# EAGLE design Small_robot_PCB_schematic (EAGLE 7.7.0)
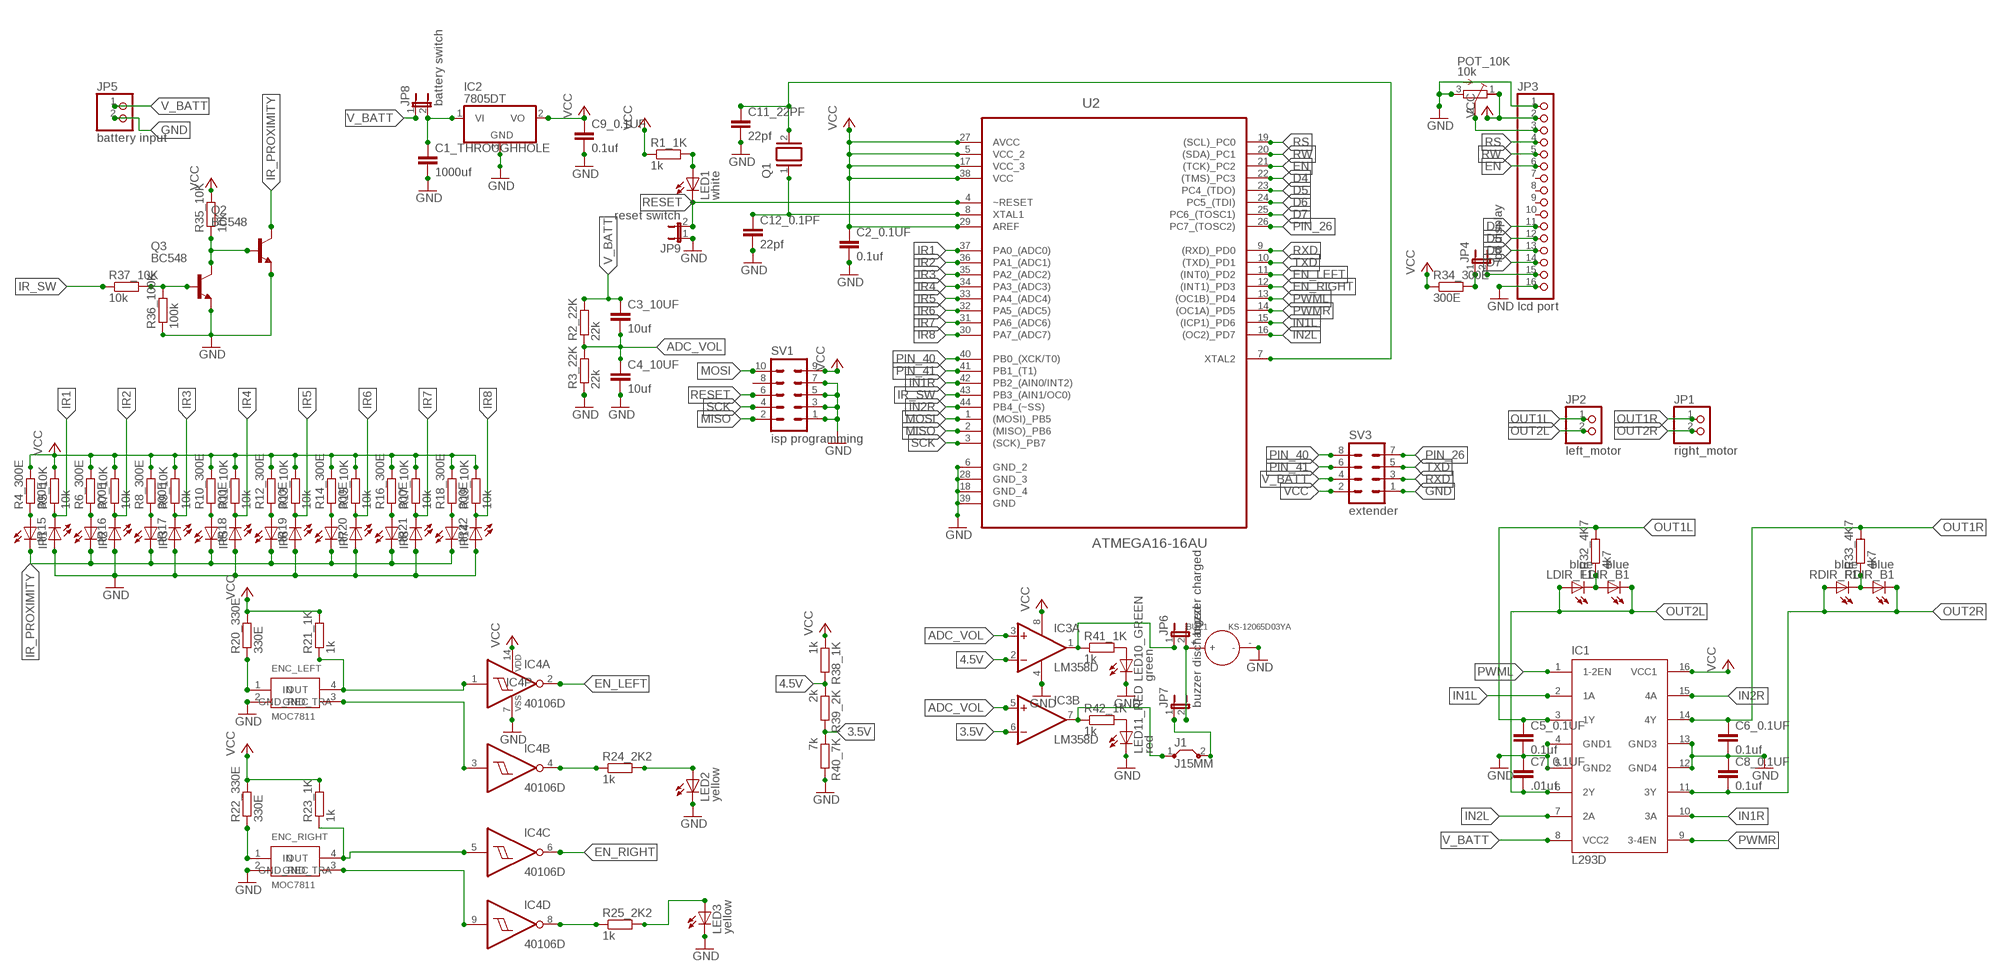
[diagram p0: schematic, sheet 1]

## Parts
BUZ1  KS-12065D03YA  DIP-BUZZER-3V(KS-12065D03YA)  [BZ2-7.6-D12.0XH6.5MM]
C1_THROUGHHOLE  1000uf  C-EU050-045X075  [C050-045X075]
C2_0.1UF  0.1uf  C-EUC1206  [C1206]
C3_10UF  10uf  C-EUC1206  [C1206]
C4_10UF  10uf  C-EUC1206  [C1206]
C5_0.1UF  0.1uf  C-EUC1206  [C1206]
C6_0.1UF  0.1uf  C-EUC1206  [C1206]
C7_0.1UF  .01uf  C-EUC1206  [C1206]
C8_0.1UF  0.1uf  C-EUC1206  [C1206]
C9_0.1UF  0.1uf  C-EUC1206  [C1206]
C11_22PF  22pf  C-EUC1206  [C1206]
C12_0.1PF  22pf  C-EUC1206  [C1206]
ENC_LEFT  MOC7811  [THROUGH_HOLE_NORMAL]
ENC_RIGHT  MOC7811  [THROUGH_HOLE_NORMAL]
IC1  L293D  [DIL16]
IC2  7805DT  [TO252]
IC3  LM358D  [SO08]
IC4  40106D  [SO14]
IR1  LED5MM  [LED5MM]
IR2  LED5MM  [LED5MM]
IR3  LED5MM  [LED5MM]
IR5  LED5MM  [LED5MM]
IR6  LED5MM  [LED5MM]
IR7  LED5MM  [LED5MM]
IR8  LED5MM  [LED5MM]
IR14  LED5MM  [LED5MM]
IR15  LED5MM  [LED5MM]
IR16  LED5MM  [LED5MM]
IR17  LED5MM  [LED5MM]
IR18  LED5MM  [LED5MM]
IR19  LED5MM  [LED5MM]
IR20  LED5MM  [LED5MM]
IR21  LED5MM  [LED5MM]
IR22  LED5MM  [LED5MM]
J1  J15MM  [15]
JP1  right_motor  PINHD-1X2  [1X02]
JP2  left_motor  PINHD-1X2  [1X02]
JP3  lcd port  PINHD-1X16  [1X16]
JP4  lcd display  JP1E  [JP1]
JP5  battery input  PINHD-1X2  [1X02]
JP6  buzzer charged  JP1E  [JP1]
JP7  buzzer discharged  JP1E  [JP1]
JP8  battery switch  JP1E  [JP1]
JP9  reset switch  JP1E  [JP1]
LDIR_B1  blue  LEDCHIPLED_1206  [CHIPLED_1206]
LDIR_F1  blue  LEDCHIPLED_1206  [CHIPLED_1206]
LED1  white  LEDCHIPLED_1206  [CHIPLED_1206]
LED2  yellow  LEDCHIPLED_1206  [CHIPLED_1206]
LED3  yellow  LEDCHIPLED_1206  [CHIPLED_1206]
LED10_GREEN  green  LEDCHIPLED_1206  [CHIPLED_1206]
LED11_RED  red  LEDCHIPLED_1206  [CHIPLED_1206]
POT_10K  10k  R-TRIMMT93YA  [RTRIMT93YA]
Q1  XTAL  [Q]
Q2  BC548  [TO92-EBC]
Q3  BC548  [TO92-EBC]
R1_1K  1k  R-EU_R1206  [R1206]
R2_22K  22k  R-EU_R1206  [R1206]
R3_22K  22k  R-EU_R1206  [R1206]
R4_300E  300E  R-EU_R1206  [R1206]
R5_10K  10k  R-EU_R1206  [R1206]
R6_300E  300E  R-EU_R1206  [R1206]
R7_10K  10k  R-EU_R1206  [R1206]
R8_300E  300E  R-EU_R1206  [R1206]
R9_10K  10k  R-EU_R1206  [R1206]
R10_300E  300E  R-EU_R1206  [R1206]
R11_10K  10k  R-EU_R1206  [R1206]
R12_300E  300E  R-EU_R1206  [R1206]
R13_10K  10k  R-EU_R1206  [R1206]
R14_300E  300E  R-EU_R1206  [R1206]
R15_10K  10k  R-EU_R1206  [R1206]
R16_300E  300E  R-EU_R1206  [R1206]
R17_10K  10k  R-EU_R1206  [R1206]
R18_300E  300E  R-EU_R1206  [R1206]
R19_10K  10k  R-EU_R1206  [R1206]
R20_330E  330E  R-EU_R1206  [R1206]
R21_1K  1k  R-EU_R1206  [R1206]
R22_330E  330E  R-EU_R1206  [R1206]
R23_1K  1k  R-EU_R1206  [R1206]
R24_2K2  1k  R-EU_R1206  [R1206]
R25_2K2  1k  R-EU_R1206  [R1206]
R32_4K7  4k7  R-EU_R1206  [R1206]
R33_4K7  4k7  R-EU_R1206  [R1206]
R34_300E  300E  R-EU_R1206  [R1206]
R35_10K  10k  R-EU_R1206  [R1206]
R36_100K  100k  R-EU_R1206  [R1206]
R37_10K  10k  R-EU_R1206  [R1206]
R38_1K  1k  R-EU_R1206  [R1206]
R39_2K  2k  R-EU_R1206  [R1206]
R40_7K  7k  R-EU_R1206  [R1206]
R41_1K  1k  R-EU_R1206  [R1206]
R42_1K  1k  R-EU_R1206  [R1206]
RDIR_B1  blue  LEDCHIPLED_1206  [CHIPLED_1206]
RDIR_F1  blue  LEDCHIPLED_1206  [CHIPLED_1206]
SV1  isp programming  MA05-2  [MA05-2]
SV3  extender  MA04-2  [MA04-2]
U2  ATMEGA16-16AU  [QFP80P1200X1200X120-44N]

## Nets
3.5V: IC3.6(B:-IN) R39_2K.2 R40_7K.1
4.5V: IC3.2(A:-IN) R38_1K.2 R39_2K.1
ADC_VOL: C3_10UF.2 C4_10UF.1 IC3.3(A:+IN) IC3.5(B:+IN) R2_22K.1 R3_22K.2
D4: JP3.11 U2.22((TMS)_PC3)
D5: JP3.12 U2.23(PC4_(TDO))
D6: JP3.13 U2.24(PC5_(TDI))
D7: JP3.14 U2.25(PC6_(TOSC1))
EN: JP3.6 U2.21((TCK)_PC2)
EN_LEFT: IC4.2(A:O) U2.11((INT0)_PD2)
EN_RIGHT: IC4.6(C:O) U2.12((INT1)_PD3)
GND: BUZ1.- C1_THROUGHHOLE.2 C2_0.1UF.2 C4_10UF.2 C5_0.1UF.2 C6_0.1UF.2 C7_0.1UF.1 C8_0.1UF.1 C9_0.1UF.2 C11_22PF.2 C12_0.1PF.2 ENC_LEFT.2(GND_TRA) ENC_RIGHT.2(GND_TRA) IC1.4(GND1) IC1.5(GND2) IC1.12(GND4) IC1.13(GND3) IC2.3(GND) IC3.4(P:V-) IC4.7(P:VSS) IR15.A IR16.A IR17.A IR18.A IR19.A IR20.A IR21.A IR22.A JP3.1 JP3.16 JP5.2 JP9.1 LED2.C LED3.C LED10_GREEN.C LED11_RED.C POT_10K.3(A) Q2.E Q3.E R3_22K.1 R36_100K.1 R40_7K.2 SV1.1 SV1.3 SV1.5 SV1.7 SV3.1 U2.6(GND_2) U2.18(GND_4) U2.28(GND_3) U2.39(GND)
IN1L: IC1.2(1A) U2.15((ICP1)_PD6)
IN1R: IC1.10(3A) U2.42(PB2_(AIN0/INT2))
IN2L: IC1.7(2A) U2.16((OC2)_PD7)
IN2R: IC1.15(4A) U2.44(PB4_(~SS))
IR1: IR15.K(C) R5_10K.1 U2.37(PA0_(ADC0))
IR2: IR16.K(C) R7_10K.1 U2.36(PA1_(ADC1))
IR3: IR17.K(C) R9_10K.1 U2.35(PA2_(ADC2))
IR4: IR18.K(C) R11_10K.1 U2.34(PA3_(ADC3))
IR5: IR19.K(C) R13_10K.1 U2.33(PA4_(ADC4))
IR6: IR20.K(C) R15_10K.1 U2.32(PA5_(ADC5))
IR7: IR21.K(C) R17_10K.1 U2.31(PA6_(ADC6))
IR8: IR22.K(C) R19_10K.1 U2.30(PA7_(ADC7))
IR_PROXIMITY: IR1.K(C) IR2.K(C) IR3.K(C) IR5.K(C) IR6.K(C) IR7.K(C) IR8.K(C) IR14.K(C) Q2.C
IR_SW: R37_10K.1 U2.43(PB3_(AIN1/OC0))
MISO: SV1.2 U2.2((MISO)_PB6)
MOSI: SV1.10 U2.1((MOSI)_PB5)
N: JP3.3 POT_10K.2(S)
N$1: ENC_LEFT.1(IN) R20_330E.1
N$2: C12_0.1PF.1 Q1.1 U2.8(XTAL1)
N$3: C11_22PF.1 Q1.2 U2.7(XTAL2)
N$4: IR1.A R4_300E.1
N$5: IR2.A R6_300E.1
N$6: IR3.A R8_300E.1
N$7: IR5.A R10_300E.1
N$8: LED1.A R1_1K.2
N$9: IR6.A R12_300E.1
N$10: IR7.A R14_300E.1
N$11: IR8.A R16_300E.1
N$12: IR14.A R18_300E.1
N$13: Q3.B R36_100K.2 R37_10K.2
N$14: C1_THROUGHHOLE.1 IC2.1(VI) JP8.2
N$15: IC4.4(B:O) R24_2K2.1
N$16: LED2.A R24_2K2.2
N$17: IC4.8(D:O) R25_2K2.1
N$18: LED3.A R25_2K2.2
N$19: ENC_RIGHT.1(IN) R22_330E.1
N$20: LED10_GREEN.A R41_1K.2
N$22: IC3.7(B:OUT) J1.1 R42_1K.1
N$23: ENC_RIGHT.4(OUT) IC4.5(C:I) R23_1K.1
N$24: J1.2 JP7.1
N$27: Q2.B Q3.C R35_10K.1
N$28: R33_4K7.1 RDIR_B1.A RDIR_F1.C
N$29: ENC_LEFT.4(OUT) IC4.1(A:I) R21_1K.1
N$30: ENC_LEFT.3(GND_REC) IC4.3(B:I)
N$31: ENC_RIGHT.3(GND_REC) IC4.9(D:I)
N$32: LED11_RED.A R42_1K.2
N$33: BUZ1.+ JP6.2 JP7.2
N$34: IC3.1(A:OUT) JP6.1 R41_1K.1
N$35: LDIR_B1.A LDIR_F1.C R32_4K7.1
N$39: JP3.15 JP4.2
N$49: JP4.1 R34_300E.2
OUT1L: C5_0.1UF.1 IC1.3(1Y) JP2.1 R32_4K7.2
OUT1R: C6_0.1UF.1 IC1.14(4Y) JP1.1 R33_4K7.2
OUT2L: C7_0.1UF.2 IC1.6(2Y) JP2.2 LDIR_B1.C LDIR_F1.A
OUT2R: C8_0.1UF.2 IC1.11(3Y) JP1.2 RDIR_B1.C RDIR_F1.A
PIN_26: SV3.7 U2.26(PC7_(TOSC2))
PIN_40: SV3.8 U2.40(PB0_(XCK/T0))
PIN_41: SV3.6 U2.41(PB1_(T1))
PWML: IC1.1(1-2EN) U2.13((OC1B)_PD4)
PWMR: IC1.9(3-4EN) U2.14((OC1A)_PD5)
RESET: JP9.2 LED1.C SV1.6 U2.4(~RESET)
RS: JP3.4 U2.19((SCL)_PC0)
RW: JP3.5 U2.20((SDA)_PC1)
RXD: SV3.3 U2.9((RXD)_PD0)
SCK: SV1.4 U2.3((SCK)_PB7)
TXD: SV3.5 U2.10((TXD)_PD1)
V_BATT: C3_10UF.1 IC1.8(VCC2) JP5.1 JP8.1 R2_22K.2 SV3.4
VCC [vcc]: C2_0.1UF.1 C9_0.1UF.1 IC1.16(VCC1) IC2.2(VO) IC3.8(P:V+) IC4.14(P:VDD) JP3.2 POT_10K.1(E) R1_1K.1 R4_300E.2 R5_10K.2 R6_300E.2 R7_10K.2 R8_300E.2 R9_10K.2 R10_300E.2 R11_10K.2 R12_300E.2 R13_10K.2 R14_300E.2 R15_10K.2 R16_300E.2 R17_10K.2 R18_300E.2 R19_10K.2 R20_330E.2 R21_1K.2 R22_330E.2 R23_1K.2 R34_300E.1 R35_10K.2 R38_1K.1 SV1.9 SV3.2 U2.5(VCC_2) U2.17(VCC_3) U2.27(AVCC) U2.29(AREF) U2.38(VCC)
Unconnected: IC4.10(E:O) IC4.11(E:I) IC4.12(F:O) IC4.13(F:I) JP3.7 JP3.8 JP3.9 JP3.10 SV1.8

## Library data of the parts
BUZ1 = Seeed-OPL-Connector:DIP-BUZZER-3V(KS-12065D03YA): 312010004; MPN: KS-12065D03YA
C1_THROUGHHOLE C2_0.1UF C9_0.1UF C11_22PF C12_0.1PF = resistor:C-EU: CAPACITOR, European symbol
C3_10UF C4_10UF C5_0.1UF C6_0.1UF C7_0.1UF C8_0.1UF = rcl:C-EU: CAPACITOR, European symbol
ENC_LEFT ENC_RIGHT = Motor encoder MOC7811:MOC7811: MOC7811 is a slotted opto isolator module, with an IR transmitter and a photodiode mounted on it. Performs Non-Contact Object Sensing
IC1 = st-microelectronics:L293D: PUSH-PULL 4 CHANNEL DRIVER; MPN: L293D; OC_FARNELL: 9589619; OC_NEWARK: 56P8249
IC2 = linear:78*: Positive VOLTAGE REGULATOR Source: http://cache.national.com/ds/LM/LM78L05.pdf http://www.fairchildsemi.com/ds/LM/LM7805.pdf
IC3 = linear:LM358: OP AMP also LM158; LM258; LM2904 Source: http://cache.national.com/ds/LM/LM158.pdf
IC4 = 40xx:40106: Hex SCHMITT TRIGGER
IR1-IR3 IR5-IR8 IR14-IR22 LDIR_B1 LDIR_F1 LED1-LED3 LED10_GREEN LED11_RED RDIR_B1 RDIR_F1 = led:LED: LED OSRAM: - CHIPLED LG R971, LG N971, LY N971, LG Q971, LY Q971, LO R971, LY R971 LH N974, LH R974 LS Q976, LO Q976, LY Q976 LO Q996 - Hyper CHIPLED LW Q18S LB Q993, LB Q99A, LB R99A - SideLED LS A670, LO A670, LY A670, LG A670, LP A670 LB A673, LV A673, LT A673, LW A673 LH A674 LY A675 LS A676, LA A676, LO A676, LY A676, LW A676 LS A679, LY A679, LG A679 - Hyper Micro SIDELED® LS Y876, LA Y876, LO Y876, LY Y876 LT Y87S - SmartLED LW L88C, LW L88S LB L89C, LB L89S, LG L890 LS L89K, LO L89K, LY L89K LS L896, LA L896, LO L896, LY L896 - TOPLED LS T670, LO T670, LY T670, LG T670, LP T670 LSG T670, LSP T670, LSY T670, LOP T670, LYG T670 LG T671, LOG T671, LSG T671 LB T673, LV T673, LT T673, LW T673 LH T674 LS T676, LA T676, LO T676, LY T676, LB T676, LH T676, LSB T676, LW T676 LB T67C, LV T67C, LT T67C, LS T67K, LO T67K, LY T67K, LW E67C LS E67B, LA E67B, LO E67B, LY E67B, LB E67C, LV E67C, LT E67C LW T67C LS T679, LY T679, LG T679 LS T770, LO T770, LY T770, LG T770, LP T770 LB T773, LV T773, LT T773, LW T773 LH T774 LS E675, LA E675, LY E675, LS T675 LS T776, LA T776, LO T776, LY T776, LB T776 LHGB T686 LT T68C, LB T68C - Hyper Mini TOPLED® LB M676 - Mini TOPLED Santana® LG M470 LS M47K, LO M47K, LY M47K Source: http://www.osram.convergy.de LUXEON: - LUMILED® LXK2-PW12-R00, LXK2-PW12-S00, LXK2-PW14-U00, LXK2-PW14-V00 LXK2-PM12-R00, LXK2-PM12-S00, LXK2-PM14-U00 LXK2-PE12-Q00, LXK2-PE12-R00, LXK2-PE12-S00, LXK2-PE14-T00, LXK2-PE14-U00 LXK2-PB12-K00, LXK2-PB12-L00, LXK2-PB12-M00, LXK2-PB14-N00, LXK2-PB14-P00, LXK2-PB14-Q00 LXK2-PR12-L00, LXK2-PR12-M00, LXK2-PR14-Q00, LXK2-PR14-R00 LXK2-PD12-Q00, LXK2-PD12-R00, LXK2-PD12-S00 LXK2-PH12-R00, LXK2-PH12-S00 LXK2-PL12-P00, LXK2-PL12-Q00, LXK2-PL12-R00 Source: www.luxeon.com KINGBRIGHT: KA-3528ASYC Source: www.kingbright.com
J1 = jumper:J: Bridge
JP1 JP2 JP5 = pinhead:PINHD-1X2: PIN HEADER
JP3 = pinhead:PINHD-1X16: PIN HEADER
JP4 JP6-JP9 = jumper:JP1E: JUMPER
POT_10K = resistor:R-TRIMM: Trimm resistor
Q1 = special:XTAL: CRYSTAL
Q2 Q3 = transistor-npn:BC548*: NPN Transistor
R1_1K R2_22K R3_22K R4_300E R5_10K R6_300E R7_10K R8_300E R9_10K R10_300E R11_10K R12_300E R13_10K R14_300E R15_10K R16_300E R17_10K R18_300E R19_10K R20_330E R21_1K R22_330E R23_1K R24_2K2 R25_2K2 R32_4K7 R33_4K7 R34_300E R35_10K R36_100K R37_10K R38_1K R39_2K R40_7K R41_1K R42_1K = resistor:R-EU_: RESISTOR, European symbol
SV1 = con-lstb:MA05-2: PIN HEADER; OC_FARNELL: unknown; OC_NEWARK: unknown
SV3 = con-lstb:MA04-2: PIN HEADER; OC_FARNELL: unknown; OC_NEWARK: unknown
U2 = Atmel_By_element14_Batch_1-00:ATMEGA16-16AU: 8-bit Microcontroller; DESCRIPTION: 8-bit Microcontroller; MPN: ATMEGA16-16AU; OC_FARNELL: 9171134; OC_NEWARK: 96K6515; PACKAGE: QFP-44; SUPPLIER: Atmel

## Net classes
1 vcc: width 0.584 mm

## Board
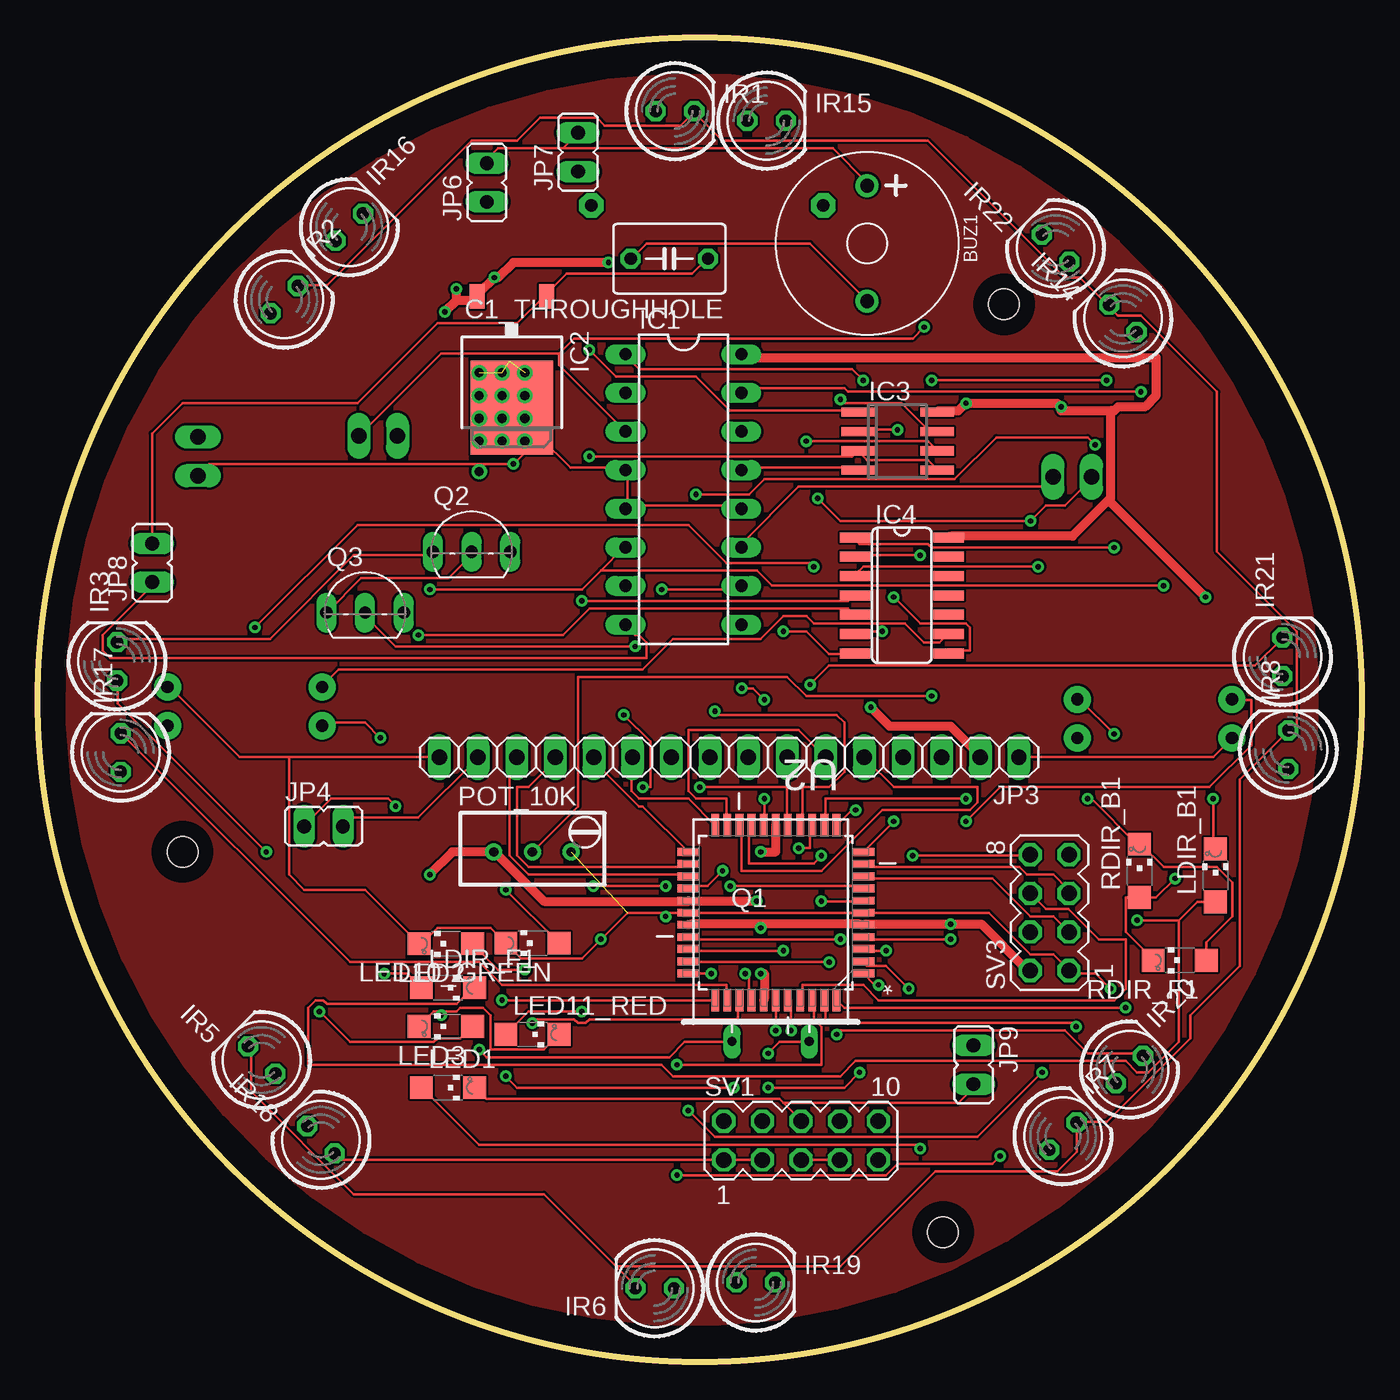
[diagram p1: board, top side]
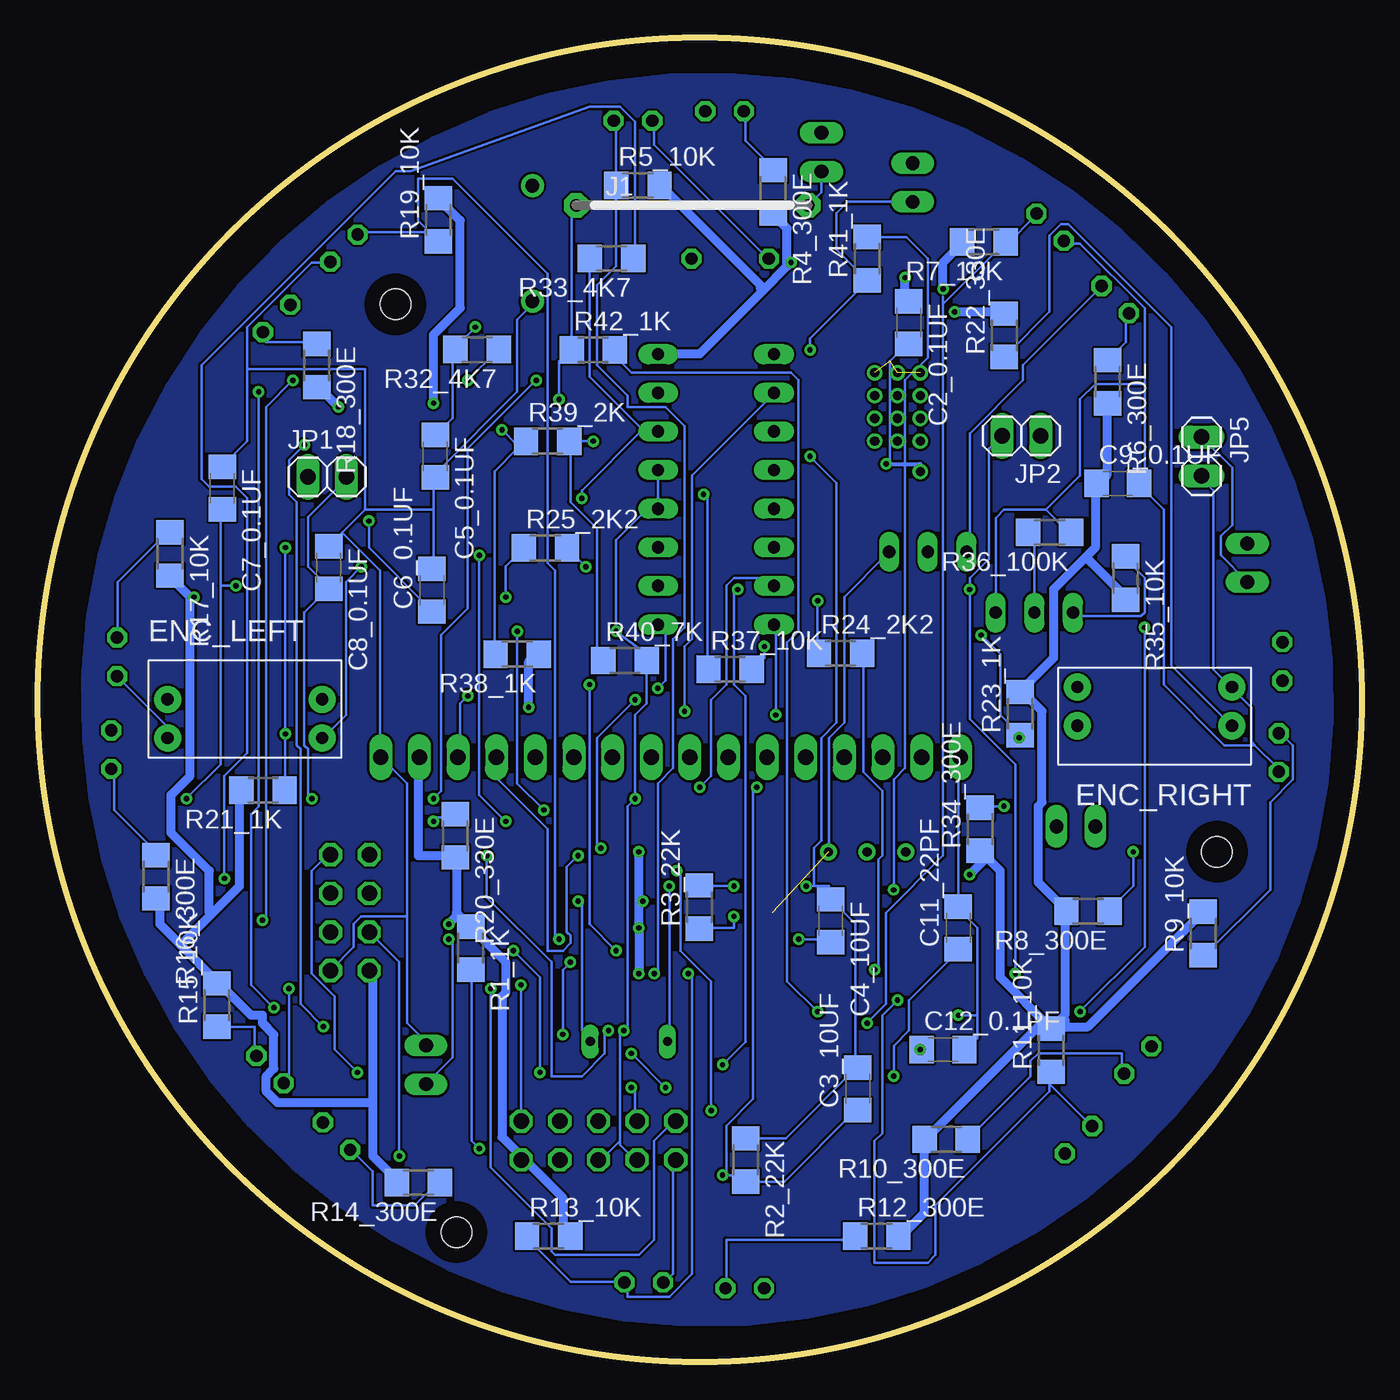
[diagram p2: board, bottom side, seen from below]

Size 87.01 x 87.01 mm. Coordinates in mm from the lower left corner, seen from the top.
Outline: circle at 43.5,43.5 radius 43.5
Copper layers (1*16): Top 0.035mm / dielectric 1.5mm / Bottom 0.035mm
Design rules "default *": minimum track width 6mil, minimum drill 0.35mm, track to track 6mil, track to pad 6mil, pad to pad 6mil, via to via 6mil, smd to smd 6mil, copper to edge 40mil, drill to drill 6mil, minimum pad ring 10mil, minimum via ring 8mil, stop-mask expansion 4mil, vias tented up to drill 0mil, thermal gap 10mil
Holes 2 mm at 59.5,8.5 9.5,33.5 63.5,69.5

### Footprints (pad centres in the part's own frame; a part is rotated, then mirrored left to right if it is on the bottom)
BZ2-7.6-D12.0XH6.5MM = drill 0.9 pad 1.5: + -3.8,0; - 3.8,0
C050-045X075 = drill 0.813 octagon: 1 -2.54,0; 2 2.54,0
C1206 = smd 1.6 x 1.8: 1 -1.4,0; 2 1.4,0
THROUGH_HOLE_NORMAL = drill 0.8 pad 1.778: 1 -5.08,1.27; 2 -5.08,-1.27; 3 5.08,-1.27; 4 5.08,1.27
DIL16 = drill 0.813 long: 1 -8.89,-3.81; 2 -6.35,-3.81; 3 -3.81,-3.81; 4 -1.27,-3.81; 5 1.27,-3.81; 6 3.81,-3.81; 7 6.35,-3.81; 8 8.89,-3.81; 9 8.89,3.81; 10 6.35,3.81; 11 3.81,3.81; 12 1.27,3.81; 13 -1.27,3.81; 14 -3.81,3.81; 15 -6.35,3.81; 16 -8.89,3.81
TO252 = smd 1 x 1.6: 1 -2.28,-4.8; 2 2.28,-4.8 | smd 5.4 x 6.2: 3 0,2.5
SO08 = smd 0.6 x 2.2: 1 -1.905,-2.6; 2 -0.635,-2.6; 3 0.635,-2.6; 4 1.905,-2.6; 5 1.905,2.6; 6 0.635,2.6; 7 -0.635,2.6; 8 -1.905,2.6
SO14 = smd 0.66 x 2.032: 1 -3.81,-3.073; 2 -2.54,-3.073; 3 -1.27,-3.073; 4 0,-3.073; 5 1.27,-3.073; 6 2.54,-3.073; 7 3.81,-3.073; 8 3.81,3.073; 9 2.54,3.073; 10 1.27,3.073; 11 0,3.073; 12 -1.27,3.073; 13 -2.54,3.073; 14 -3.81,3.073
LED5MM = drill 0.813 octagon: A -1.27,0; K 1.27,0
15 = drill 0.813 pad 1.6 octagon: 1 -7.62,0; 2 7.62,0
1X02 = drill 1.016 long: 1 -1.27,0; 2 1.27,0
1X16 = drill 1.016 long: 1 -19.05,0; 2 -16.51,0; 3 -13.97,0; 4 -11.43,0; 5 -8.89,0; 6 -6.35,0; 7 -3.81,0; 8 -1.27,0; 9 1.27,0; 10 3.81,0; 11 6.35,0; 12 8.89,0; 13 11.43,0; 14 13.97,0; 15 16.51,0; 16 19.05,0
JP1 = drill 0.914 long: 1 0,-1.27; 2 0,1.27
CHIPLED_1206 = smd 1.5 x 1.5: A 0,-1.75; C 0,1.75
RTRIMT93YA = drill 0.61: 1 0,-2.54; 2 0,0; 3 0,2.54
Q = drill 0.61 long: 1 -2.54,-7.62; 2 2.54,-7.62
TO92-EBC = drill 0.813 long: B 0,-1.27; C -2.54,-1.27; E 2.54,-1.27
R1206 = smd 1.6 x 1.803: 1 -1.422,0; 2 1.422,0
MA05-2 = drill 1.016 octagon: 1 -5.08,-1.27; 2 -5.08,1.27; 3 -2.54,-1.27; 4 -2.54,1.27; 5 0,-1.27; 6 0,1.27; 7 2.54,-1.27; 8 2.54,1.27; 9 5.08,-1.27; 10 5.08,1.27
MA04-2 = drill 1.016 octagon: 1 -3.81,-1.27; 2 -3.81,1.27; 3 -1.27,-1.27; 4 -1.27,1.27; 5 1.27,-1.27; 6 1.27,1.27; 7 3.81,-1.27; 8 3.81,1.27
QFP80P1200X1200X120-44N = smd 1.473 x 0.508: 1 -5.74,3.988; 2 -5.74,3.2; 3 -5.74,2.388; 4 -5.74,1.6; 5 -5.74,0.787; 6 -5.74,0; 7 -5.74,-0.787; 8 -5.74,-1.6; 9 -5.74,-2.388; 10 -5.74,-3.2; 11 -5.74,-3.988; 23 5.74,-3.988; 24 5.74,-3.2; 25 5.74,-2.388; 26 5.74,-1.6; 27 5.74,-0.787; 28 5.74,0; 29 5.74,0.787; 30 5.74,1.6; 31 5.74,2.388; 32 5.74,3.2; 33 5.74,3.988 | smd 0.508 x 1.473: 12 -3.988,-5.74; 13 -3.2,-5.74; 14 -2.388,-5.74; 15 -1.6,-5.74; 16 -0.787,-5.74; 17 0,-5.74; 18 0.787,-5.74; 19 1.6,-5.74; 20 2.388,-5.74; 21 3.2,-5.74; 22 3.988,-5.74; 34 3.988,5.74; 35 3.2,5.74; 36 2.388,5.74; 37 1.6,5.74; 38 0.787,5.74; 39 0,5.74; 40 -0.787,5.74; 41 -1.6,5.74; 42 -2.388,5.74; 43 -3.2,5.74; 44 -3.988,5.74

### Placement (x,y rotation side)
BUZ1  54.5,73.5 270 top
C1_THROUGHHOLE  41.5,72.5 180 top
C2_0.1UF  29.76,68.29 270 bottom
C3_10UF  33.11,17.92 90 bottom
C4_10UF  34.89,28.97 270 bottom
C5_0.1UF  60.89,59.52 270 bottom
C6_0.1UF  61.11,50.7 90 bottom
C7_0.1UF  74.89,57.41 270 bottom
C8_0.1UF  67.89,52.19 270 bottom
C9_0.1UF  16.01,57.72 0 bottom
C11_22PF  26.5,28.5 90 bottom
C12_0.1PF  27.5,20.5 0 bottom
ENC_LEFT  73.41,42.26 0 bottom
ENC_RIGHT  13.59,43.06 180 bottom
IC1  42.43,57.33 270 top
IC2  31.14,65.21 180 top
IC3  56.5,60.5 270 top
IC4  56.79,50.36 270 top
IR1  41.87,82.19 0 top
IR2  16.18,69.81 45 top
IR3  5.19,46.02 90 top
IR5  14.7,19.81 135 top
IR6  40.54,4.81 180 top
IR7  67.38,14.81 45 top
IR8  82.19,40.22 90 top
IR14  71.32,68.57 135 top
IR15  47.89,81.57 0 top
IR16  20.46,74.57 45 top
IR17  5.43,40.03 90 top
IR18  18.6,14.57 135 top
IR19  47.18,5.19 0 top
IR20  71.75,19.19 45 top
IR21  81.81,46.32 90 top
IR22  66.89,73.19 135 top
J1  44,76 0 bottom
JP1  67.99,58.16 0 bottom
JP2  22.36,60.84 180 bottom
JP3  45.43,39.72 180 top
JP4  18.77,35.18 270 top
JP5  10.5,59.5 270 bottom
JP6  29.5,77.5 0 top
JP7  35.5,79.5 0 top
JP8  7.5,52.5 0 top
JP9  61.5,19.5 180 top
LDIR_B1  77.4,31.95 0 top
LDIR_F1  26.95,24.57 270 top
LED1  26.95,18 270 top
LED2  26.81,27.46 90 top
LED3  26.81,22.03 90 top
LED10_GREEN  32.5,27.5 90 top
LED11_RED  32.5,21.5 270 top
POT_10K  32.5,33.5 270 top
Q1  48.16,28.66 0 top
Q2  28.5,54.5 0 top
Q3  21.5,50.5 0 top
R1_1K  58.56,27.17 270 bottom
R2_22K  40.48,13.24 270 bottom
R3_22K  43.52,29.87 90 bottom
R4_300E  38.68,76.89 270 bottom
R5_10K  47.57,77.32 0 bottom
R6_300E  16.68,64.41 270 bottom
R7_10K  24.82,73.6 180 bottom
R8_300E  17.98,29.6 180 bottom
R9_10K  10.4,28.14 90 bottom
R10_300E  27.3,14.6 180 bottom
R11_10K  20.4,20.46 90 bottom
R12_300E  31.86,8.24 0 bottom
R13_10K  53.43,8.24 0 bottom
R14_300E  62,11.76 180 bottom
R15_10K  75.24,23.43 90 bottom
R16_300E  79.24,31.86 270 bottom
R17_10K  78.32,53.09 270 bottom
R18_300E  68.68,65.48 270 bottom
R19_10K  60.68,75.05 90 bottom
R20_330E  59.56,34.55 270 bottom
R21_1K  72.21,37.56 180 bottom
R22_330E  23.48,67.46 90 bottom
R23_1K  22.44,42.59 90 bottom
R24_2K2  34.24,46.56 0 bottom
R25_2K2  53.65,53.48 0 bottom
R32_4K7  58.14,66.52 180 bottom
R33_4K7  49.3,72.52 180 bottom
R34_300E  25.07,34.99 90 bottom
R35_10K  15.5,51.5 270 bottom
R36_100K  20.5,54.5 180 bottom
R37_10K  41.5,45.5 0 bottom
R38_1K  55.5,46.5 180 bottom
R39_2K  53.5,60.5 0 bottom
R40_7K  48.42,46.08 0 bottom
R41_1K  32.5,72.5 90 bottom
R42_1K  50.5,66.5 0 bottom
RDIR_B1  72.41,32.25 0 top
RDIR_F1  75.05,26.37 90 top
SV1  50.16,14.52 0 top
SV3  66.5,29.5 90 top
U2  48.5,29.5 180 top

### Tracks (layer width: path | path; a pad name or v marks a point on that pad's centre or on a via)
3.5V  (via drill 0.35)
  Top 0.152: v50.5,60.5 58.5,60.5 59,60 IC3.6
  Bottom 0.152: 52,60.5 52,56.5 50.25,54.75 50.25,46.5 50,46.25 R40_7K.1 | 52,60.5 v50.5,60.5 | 52,60.5 R39_2K.2
4.5V  (via drill 0.35)
  Top 0.152: v56.5,61.25 54,61.25 IC3.2
  Bottom 0.152: 55.5,60 55,60.5 R39_2K.1 55.5,60 | 55.5,60 57,58.5 57,46.5 R38_1K.2 | v56.5,61.25 55.5,60.25 55.5,60
ADC_VOL  (via drill 0.35)
  Top 0.152: IC3.5 59,58.75 58.5,59.25 54.5,59.25 54,59.75 IC3.3 53.75,59.75 53.5,59.5 v36.25,59.5 | v36.5,31.25 v41.25,31.25
  Bottom 0.152: 40.25,14.75 R2_22K.1 37.84,14.66 33.25,19.25 C3_10UF.2 33.25,19.5 33.25,28.75 34.75,30.25 C4_10UF.1 35,30.5 35,31.25 36,31.25 | v41.25,31.25 43.5,31.25 R3_22K.2 | 36,31.25 v36.5,31.25 | v36.25,59.5 34.5,57.75 34.5,42 35.5,41 35.5,34.25 36,33.75 36,31.25
D4
  Top 0.152: U2.22 42.75,37 39.5,37 39,37.5 39,39.5 JP3.11
D5
  Top 0.152: U2.23 39.75,36.5 39.5,36.5 36.5,39.5 JP3.12
D6
  Top 0.152: U2.24 42.75,32.5 32.25,32.5 31.5,33.25 31.5,37.75 32.25,37.75 34,39.5 JP3.13
D7
  Top 0.152: U2.25 42.75,32 32.25,32 31,33.25 31,39.5 31.25,39.5 JP3.14
EN
  Top 0.152: JP3.6 50,41.5 42.75,41.5 42.75,37.5 43.25,37 45.25,37 45.25,35.25 U2.21
EN_LEFT  (via drill 0.35)
  Top 0.152: v56.25,35.5 U2.11 | v58,53 53.75,53 IC4.2
  Bottom 0.152: v56.25,35.5 58,37.25 v58,53
EN_RIGHT  (via drill 0.35)
  Top 0.152: v53.75,36.25 53.5,36.25 U2.12 | v55.5,48 53.75,48 IC4.6
  Bottom 0.152: v53.75,36.25 55.5,38 v55.5,48
GND  (via drill 0.35, 0.6)  (4 unrouted)
  Top 0.152: 26.5,23 27.5,23 27.75,23.25 29.25,23.25 29.75,22.75 29.75,20.5 33.25,20.5 LED11_RED.C | 26.5,23 26,23 25.25,22.25 LED3.C | v26.5,22.75 26.5,23 | 16.5,39.75 26.25,39.75 JP3.16 | 16.5,39.75 13.25,39.75 8.75,44.25 ENC_RIGHT.2 | v48.5,21.75 U2.39 | SV1.5 SV1.7 | IR18.A 19.5,13.5 19.75,13.25 SV1.1 SV1.3 | v47.75,37 47.75,35.25 U2.18 | IC4.7 53.5,46.5 52,46.5 50.5,48 v49,48 | 38.75,56.25 38.75,58.5 IC1.4 38.5,58.75 35,58.75 33,60.75 | IC3.4 53.75,58.75 46.25,58.75 IC1.13 | 38.75,56.25 46,56.25 IC1.12 | 38.75,56.25 IC1.5 | 33,60.75 31.25,62.5 IC2.3 32.39,61.4 33,60.75 | 33,60.75 v31.25,59 11.25,59 10.5,58.25 JP5.2 | C1_THROUGHHOLE.2 39,72.5 40,73.5 50.75,73.5 54.5,69.75 BUZ1.- | 41.25,29.5 U2.28 U2.6 62.5,29.5 65.25,26.75 66.75,26.75 67.75,25.75 SV3.1 68,25.5 69.5,25.5 v70.5,24.5 | 41.25,29.5 38.75,29.5 v37,27.75 35.75,26.5 31.75,26.5 LED10_GREEN.C 29.75,28.5 26.25,28.5 25.25,27.5 LED2.C 25,27.5 21.5,31 17.5,31 16.5,32 16.5,39.75 | 41.25,29.5 v41.25,29.25 | ENC_LEFT.2 77.25,39.75 64.5,39.75 JP3.1
  Top 0.254: 32.39,60.5 32.39,61.4
  Bottom 0.152: 20.75,56 19.25,54.5 R36_100K.1 | 24,49.25 Q3.E 24.04,55.46 23.5,56 20.75,56 | 14.25,64.25 14.25,69.25 18.5,73.5 19.5,73.5 IR16.A | 14.25,64.25 14.25,58 14.5,57.75 C9_0.1UF.2 14.5,57.5 13,56 13,44.5 9,40.5 7,40.5 | 20.75,56 18.5,58.25 18.5,63.25 17.5,64.25 14.25,64.25 | 7,40.5 7.25,40.75 7.25,43 8.5,44.25 ENC_RIGHT.2 8.75,44.5 9.75,45.5 9.75,57.25 10.5,58 JP5.2 | 7,40.5 5.5,39 IR17.A | 25.25,22.75 25.25,28.5 26.5,29.75 C11_22PF.2 26.5,39.5 JP3.16 | 25.25,22.75 25.25,21.25 26,20.5 C12_0.1PF.2 | 25.25,22.75 v26.5,22.75 | 48.75,14.5 48.75,14.25 47.75,13.25 SV1.3 | 48.75,14.5 48.75,21.5 v48.5,21.75 48.25,22 48.25,36.5 v47.75,37 47.75,42.5 47,43.25 47,46 R40_7K.2 47,46.25 47,46.5 v49,48 49,54 46.94,56.06 IC1.12 | 48.75,14.5 50,13.25 SV1.5 | IR19.A 45.75,5.25 45.25,5.75 45.25,13.25 SV1.1 | C2_0.1UF.2 30,66.75 31,65.75 31,59 v31.25,59 | 31,53.25 Q2.E 31.25,53 34,50.25 34,42 35,41 35,33.5 POT_10K.3 | IC1.12 46.25,56.25 46.25,58.5 IC1.13 | 46.25,56 IC1.12 | 73.25,65.25 73.25,68 69,72.25 68,72.25 IR22.A | 73.25,65.25 73.25,60.5 74.75,59 C7_0.1UF.1 | C1_THROUGHHOLE.2 39,72.5 46.5,80 46.5,81.5 IR15.A | 61,56 61,52.25 C6_0.1UF.2 | 61,56 61,58 C5_0.1UF.2 60.75,58.25 60.75,58.5 55.5,63.75 55.5,68.5 54.5,69.5 BUZ1.- | 65.5,56 67,54.5 | 67,54.5 67.75,53.75 C8_0.1UF.1 | 61,56 65.5,56 | 73.25,65.25 65.5,65.25 65.5,56 | v37,27.75 35,27.75 C4_10UF.2 | v41.25,29.25 41.25,28.5 43.5,28.5 R3_22K.1 | v70.5,24.5 70.5,18.75 70.75,18.5 IR20.A | IR21.A 81.75,45 78.5,41.75 ENC_LEFT.2 | 62.75,29.25 62.75,38 64.25,39.5 JP3.1 64.5,39.75 64.5,52 67,54.5 | 62.75,29.25 62.75,22.25 61.5,21 JP9.1 | 62.75,29.25 65.75,29.25 66.25,28.75 66.25,27.25 67.75,25.75 SV3.1
  Bottom 0.254: 31,59 29,59 v29,58.5
  other vias: 29,65 30.5,65 32,65
IN1L  (via drill 0.35)
  Top 0.152: U2.15 50.25,35.25 50.25,37.75 52,37.75 53,38.75 53,42 52.5,42.5 44.75,42.5 v44.5,42.75
  Bottom 0.152: IC1.2 38.75,63.5 44,58.25 44,47.5 44.5,47 v44.5,42.75
IN1R  (via drill 0.35)
  Top 0.152: v42,19.5 51.5,19.5 51.5,22 51,22.5 51,23.75 U2.42 | v41,50.75 46,50.75 IC1.10
  Bottom 0.152: v42,19.5 40.5,21 40.5,43.75 41.25,44.5 41.25,50.5 v41,50.75
IN2L  (via drill 0.35)
  Top 0.152: v43.5,37.75 49.25,37.75 49.25,35.25 U2.16
  Bottom 0.152: v43.5,37.75 42.75,38.5 42.75,43.5 41.75,44.5 41.75,51 41.25,51.5 38.75,51.5 38.75,51 IC1.7
IN2R  (via drill 0.35)
  Top 0.152: v71.5,23.25 53,23.25 U2.44 | v72.5,63.75 53.25,63.75 53,64 46.5,64 46.25,63.75 IC1.15
  Bottom 0.152: v71.5,23.25 73,24.75 73,36 72.5,36.5 v72.5,63.75
IR1  (via drill 0.35)
  Top 0.152: v46.5,25.5 46.75,25.5 46.75,24 U2.37
  Bottom 0.152: v46.5,25.5 46.25,25.75 46.25,38 45.25,39 45.25,47.5 44.5,48.25 44.5,61.5 45.75,62.75 48.25,62.75 48.25,63.5 50.25,65.5 50.25,70.75 49,72 49,77.25 R5_10K.1 49,77.5 49,81.5 IR15.K
IR2  (via drill 0.35)
  Top 0.152: v32.5,22.25 32.75,22.5 35.25,22.5 35.5,22.25 36,22.25 36.25,22.5 46,22.5 46,23.75 U2.36
  Bottom 0.152: v32.5,22.25 31.25,23.5 31.25,29.5 27.5,33.25 27.5,33.75 | 27.5,33.75 27.5,69.5 23.5,73.5 R7_10K.1 23.25,73.5 21.5,75.25 IR16.K | 27.5,70 27.5,33.75
IR3
  Top 0.152: U2.35 45.25,24 45.25,24.75 30.5,24.75 29,26.25 20.5,26.25 5.5,41.25 IR17.K
  Bottom 0.152: R9_10K.1 10.25,26.75 6,31 6,36.75 4.5,38.25 4.5,40.5 5.25,41.25 IR17.K
IR4  (via drill 0.35)
  Top 0.152: v30.5,23.75 U2.34
  Bottom 0.152: v30.5,23.75 31.5,22.75 31.5,15 32,14.5 32,6.5 28.5,6.5 28,7 28,10.25 20.5,17.75 20.5,18.25 | 20.5,18.25 20.5,19 R11_10K.1 20.5,18.25 | 20.5,18.25 17.75,15.5 IR18.K
IR5  (via drill 0.35)
  Top 0.152: v44.25,25.5 43,25.5 U2.33
  Bottom 0.152: v44.25,25.5 44,25.25 44,5.75 45.5,4.25 48.25,4.25 48.25,5 IR19.K 48.5,5.25 52,5.25 54.75,8 R13_10K.1
IR6  (via drill 0.35)
  Top 0.152: v52,26.25 43,26.25 U2.32 | v52.5,21.5 52.75,21.75 67.5,21.75 69,20.25 72.5,20.25 IR20.K
  Bottom 0.152: v52,26.25 52.5,25.75 v52.5,21.5 | R15_10K.1 75,22 72.75,22 72.75,20.25 IR20.K
IR7  (via drill 0.35)
  Top 0.152: v49,27 43,27 U2.31 | v50.75,44.5 52,45.75 80,45.75 81.75,47.5 IR21.K
  Bottom 0.152: v49,27 50.75,28.75 v50.75,44.5 | R17_10K.1 78.5,54.5 81.75,51.25 81.75,47.75 IR21.K
IR8  (via drill 0.35)
  Top 0.152: v52.75,27.75 43,27.75 U2.30
  Bottom 0.152: v52.75,27.75 53,28 53,52 53.5,52.5 53.5,71.5 59.75,77.75 62,77.75 62,75 61.25,74.25 | 61.25,74.25 60.75,73.75 R19_10K.1 61.25,74.25 | 61.25,74.25 65.75,74.25 IR22.K
IR_PROXIMITY
  Top 0.152: IR3.K 5.25,47.5 15.25,47.5 20.75,53 25.75,53 Q2.C | IR2.K 17.25,70.75 19,70.75 28.5,80.25 31.5,80.25 33,81.75 36.75,81.75 37.25,81.25 42.25,81.25 43,82 IR1.K 43.25,82 45,80.25 58.5,80.25 67.5,71.25 68.5,71.25 70.25,69.5 IR14.K 70.5,69.25 71,68.75 72.5,68.75 77.5,63.75 77.5,53.25 82.75,48 82.75,41.5 82.25,41.5 IR8.K 82,41.25 79,38.25 79,26 75.75,22.75 75.75,21.25 70.25,15.75 68.5,15.75 IR7.K | 38,6.25 33.25,11 20.75,11 14,17.75 14,20.5 IR5.K | 38,6.25 39.25,5 IR6.K | 38,6.25 52.75,6.25 59,12.5 67,12.5 68.28,13.78 IR7.K | 68.25,15.5 IR7.K
  Bottom 0.152: IR2.K 17.25,70.5 22.25,65.5 22.25,64.5 25.75,61 25.75,53.25 Q2.C
IR_SW  (via drill 0.35)
  Top 0.152: v68.25,22 68,22.25 51.75,22.25 51.75,23.75 U2.43 | v69.5,60.25 69,60.75 63,60.75 60.25,58 47.75,58 46.75,57 v43.25,57
  Bottom 0.152: v68.25,22 69.75,23.5 69.75,40.25 70,40.5 70,56.5 70.5,57 70.5,59.25 v69.5,60.25 | v43.25,57 43,56.75 43,45.5 R37_10K.1
MISO  (via drill 0.35)
  Top 0.152: v57.25,24.5 55.75,26 54.5,26 54.25,26.25 U2.2
  Bottom 0.152: v57.25,24.5 57.25,12.75 53.25,8.75 53.25,7.25 53,7 47.5,7 46.5,8 46.5,14.5 45.25,15.75 SV1.2
MOSI  (via drill 0.35)
  Top 0.152: v55.25,24.75 55,24.75 U2.1
  Bottom 0.152: v55.25,24.75 55.25,16 SV1.10
N  (via drill 0.35)
  Top 0.152: POT_10K.2 35.5,36.5 35.5,45 49.25,45 50.5,43.75 v58.75,43.75
  Bottom 0.152: v58.75,43.75 59.25,43.25 59.25,39.75 JP3.3
N$1  (via drill 0.35)
  Top 0.152: v61,35.5 63.25,37.75 77,37.75 79.75,40.5 79.75,43.5 78.5,43.5 ENC_LEFT.1
  Bottom 0.152: v61,35.5 61,35.75 59.75,35.75 R20_330E.1
N$2  (via drill 0.35)
  Top 0.152: v45.5,31.25 54,31.25 U2.8 | Q1.1 45.5,21 42.5,21 41.5,20 29.5,20 v29,20.5
  Bottom 0.152: v45.5,31.25 45.5,21.25 Q1.1 | v29,20.5 C12_0.1PF.1
N$3  (via drill 0.35)
  Top 0.152: v51.5,30.25 54,30.25 U2.7 | v30.75,18.75 31.5,18 v45.75,18 | v48,20.25 48.75,21 50.5,21 Q1.2
  Bottom 0.152: v51.5,30.25 51.25,30 51.25,21.75 50.75,21.25 Q1.2 | v30.75,18.75 30.75,20.75 29.75,21.75 29.75,23.75 26.5,27 C11_22PF.1 | v48,20.25 v45.75,18
N$4
  Bottom 0.152: R4_300E.1 38.75,78.5 40.5,80.25 40.5,82 IR1.A
N$5
  Bottom 0.152: R6_300E.1 16.5,66 15.5,67 15.5,68.75 IR2.A
N$6  (via drill 0.35)
  Top 0.152: v15,33.5 5.25,43.25 5.25,44.75 IR3.A
  Bottom 0.152: v15,33.5 15,31.25 16.5,29.75 R8_300E.1
N$7
  Bottom 0.152: R10_300E.1 25.75,14.75 21.75,18.75 21.75,19.75 21.25,20.25 15.75,20.25 15.75,19 IR5.A
N$8  (via drill 0.35)
  Top 0.152: v58,14 57.75,14.25 29,14.25 25.25,18 LED1.A
  Bottom 0.152: v58,14 58.5,14.5 58.5,25.5 R1_1K.2
N$9
  Bottom 0.152: R12_300E.1 33.5,8 41.75,8 41.75,5 IR6.A
N$10
  Bottom 0.152: R14_300E.1 60.75,11.75 62.25,10.25 65,10.25 65,12.5 66.25,13.75 IR7.A
N$11
  Bottom 0.152: R16_300E.1 79.25,33.5 82,36.25 82,38.75 IR8.A
N$12
  Bottom 0.152: R18_300E.1 68.75,67 72,67 72,67.5 IR14.A
N$13  (via drill 0.35)
  Top 0.152: v39.25,47 23.5,47 21.5,49 Q3.B
  Bottom 0.152: Q3.B 21.5,54.25 21.75,54.5 R36_100K.2 | v39.25,47 39.25,46.25 40,45.5 R37_10K.2
N$14
  Top 0.152: C1_THROUGHHOLE.1 44,72.5 43,71.5 34.75,71.5 33.5,70.25 IC2.1 33.25,70 31.5,68.25 26.25,68.25 21,63 9.5,63 7.5,61 JP8.2
N$15  (via drill 0.35)
  Top 0.152: v35.75,50 53.25,50 53.5,50.25 IC4.4
  Bottom 0.152: v35.75,50 35.75,46.75 R24_2K2.1
N$16  (via drill 0.35)
  Top 0.152: v32,25.75 30.25,25.75 28.75,27.25 LED2.A
  Bottom 0.152: v32,25.75 31.75,26 31.75,33 31.5,33.25 31.5,37.5 32.75,38.75 32.75,46.5 R24_2K2.2
N$17  (via drill 0.35)
  Top 0.152: v56.25,50.25 58,48.5 61,48.5 61.25,48.25 61.25,46.75 60,46.75 IC4.8
  Bottom 0.152: v56.25,50.25 56.25,52.25 55.25,53.25 R25_2K2.1
N$18  (via drill 0.35)
  Top 0.152: v18.5,23 20.5,21 26,21 26.25,21.25 27.75,21.25 28.5,22 LED3.A | v14.25,48.25 21,55 42.75,55 45.25,52.5 50.75,52.5 v51,52.25
  Bottom 0.152: v18.5,23 14.25,27.25 v14.25,48.25 | v51,52.25 52,53.25 R25_2K2.2
N$19
  Bottom 0.152: R22_330E.1 23.25,66.25 20.5,69 20.5,74 19.75,74.75 19.25,74.75 12.5,68 12.5,45.75 8.75,42 ENC_RIGHT.1
N$20  (via drill 0.35)
  Top 0.152: v30.75,31 LED10_GREEN.A
  Bottom 0.152: v30.75,31 30.75,38.25 30,39 30,64.5 28.5,66 28.5,72.5 29.92,73.92 R41_1K.2 32.5,74
N$21
  pour Bottom: 41.5,84.5 arc-180 44.5,2.5 arc-180
  pour Top: 41.5,84.5 arc-180 44.5,2.5 arc-180
N$22  (via drill 0.35)
  Top 0.152: v52.75,63.25 53,63 56.75,63 58.5,61.25 59,61.25 IC3.7
  Bottom 0.152: v52.75,63.25 52.75,65.75 52,66.5 R42_1K.1 51.92,75.7 J1.1
N$23  (via drill 0.35)
  Top 0.152: v22.5,41 21.5,42 18.75,42 ENC_RIGHT.4 | v25,47.75 34.5,47.75 36.25,49.5 53.25,49.5 53.5,49.25 IC4.5
  Bottom 0.152: 22,41.5 22.25,41.25 | v22.5,41 22.25,41.25 | 22.25,41.25 R23_1K.1 22.5,41.25 23.75,42.5 23.75,46.5 v25,47.75
N$24
  Bottom 0.152: J1.2 35.5,76.88 JP7.1
N$27
  Top 0.152: Q2.B 28.5,53 27,51.5 21.25,51.5 19,49.25 Q3.C
  Bottom 0.152: R35_10K.1 15.5,52.75 14.25,51.5 14.25,49.25 14.5,49 18.75,49 Q3.C
N$28  (via drill 0.35)
  Top 0.152: RDIR_F1.C 73.25,26.5 71.5,28.25 71.5,30.5 RDIR_B1.A 73.5,30.5 v74.75,31.75
  Bottom 0.152: v74.75,31.75 74.75,38.5 73.25,40 73.25,56.75 74,57.5 75.75,57.5 76.25,58 76.25,65.5 63.5,78.25 62.5,78.25 50.75,82.5 48.75,82.5 47.75,81.5 47.75,72.75 R33_4K7.1
N$29  (via drill 0.35)
  Top 0.152: v70.75,41.25 68.5,43.5 ENC_LEFT.4 | v70.75,53.5 58.75,53.5 58.5,53.75 54,53.75 53.75,54 IC4.1
  Bottom 0.152: R21_1K.1 70.75,37.75 v70.75,41.25 v70.75,53.5
N$30  (via drill 0.35)
  Top 0.152: v65.75,52.25 54.25,52.25 53.75,51.75 IC4.3
  Bottom 0.152: v65.75,52.25 66.75,51.25 66.75,42.5 68.25,41 ENC_LEFT.3
N$31
  Top 0.152: IC4.9 59.75,47.75 59.25,47.25 58.25,47.25 57,48.5 51,48.5 50.5,49 49,49 47.5,47.5 41.75,47.5 39.75,45.5 19.75,45.5 18.75,44.5 ENC_RIGHT.3
N$32  (via drill 0.35)
  Top 0.152: LED11_RED.A 32.25,23 v35.75,23
  Bottom 0.152: v35.75,23 37.75,25 37.75,47.25 37,48 37,64.5 37.5,65 48,65 49.08,66.08 R42_1K.2 49,66.5
N$33
  Top 0.152: 34.5,79.75 30.25,79.75 29.5,79 JP6.2 | 34.5,79.75 35.5,80.75 JP7.2 | 34.5,79.75 52.25,79.75 54.5,77.5 BUZ1.+
N$34  (via drill 0.35)
  Top 0.152: v36.25,66.5 38,64.75 43.25,64.75 45.5,62.5 53.75,62.5 IC3.1
  Bottom 0.152: v36.25,66.5 36.25,67.25 32.5,71 R41_1K.1 34.5,73.08 34.5,75.5 33.77,76.23 JP6.1
N$35  (via drill 0.35)
  Top 0.152: LDIR_F1.C 28.5,24.5 27.5,23.5 19,23.5 18.75,23.75 18.25,23.75 17.75,23.25 17.75,19.5 41,19.5 41.75,18.75 52.75,18.75 53.75,19.75 71.5,19.75 72.25,19 73,19 75,21 75,29 | 77.25,30 LDIR_B1.A 76.2,30.2 75,29 | v70.25,64.5 v58.75,64.5 | 75,29 v72.25,29
  Bottom 0.152: v58.75,64.5 56.75,66.5 R32_4K7.1 | v70.25,64.5 72,62.75 72,29.25 v72.25,29
N$37  (via drill 0.6)
  other vias: 32,63.5
N$38  (via drill 0.6)
  other vias: 30.5,63.5
N$39
  Top 0.152: JP4.2 20.25,35.25 20.75,35.75 25,35.75 28.75,39.5 JP3.15
N$40  (via drill 0.6)
  other vias: 29,63.5
N$41  (via drill 0.6)
  other vias: 29,62
N$42  (via drill 0.6)
  other vias: 30.5,62
N$43  (via drill 0.6)
  other vias: 32,62
N$44  (via drill 0.6)
  other vias: 32,60.5
N$45  (via drill 0.6)
  other vias: 30.5,60.5
N$46  (via drill 0.6)
  other vias: 29,60.5
N$49  (via drill 0.35)
  Top 0.152: v23.5,36.5 23,37 19.25,37 17.5,35.25 JP4.1
  Bottom 0.152: v23.5,36.5 25,36.5 R34_300E.2
OUT1L  (via drill 0.35)
  Top 0.152: 34.25,66.25 34.25,65.5 38.5,61.25 IC1.3 | 34.25,66.25 26.5,66.25 JP2.1 | v58.25,68 57.5,67.25 35.25,67.25 34.25,66.25
  Bottom 0.152: C5_0.1UF.1 60.75,61 59.75,62 59.75,66.5 R32_4K7.2 59.5,66.75 v58.25,68
OUT1R  (via drill 0.35)
  Top 0.152: JP1.1 69.25,58 67.5,56.25 66.25,56.25 v65.25,55.25 52.75,55.25 v51.25,56.75
  Bottom 0.152: 47.25,61.25 50.75,64.75 50.75,72.5 R33_4K7.2 | 47.25,61.25 46.25,61.25 IC1.14 47.25,61.25 | v65.25,55.25 65.25,53.5 61.25,49.5 C6_0.1UF.1 | 47.25,61.25 51.25,57.25 v51.25,56.75
OUT2L  (via drill 0.35)
  Top 0.152: v77.25,37 77.25,33.75 LDIR_B1.C | v22.75,25.5 24.25,25.5 25,24.75 LDIR_F1.A | 37,52 35.75,50.75 v25.75,50.75 | 37,52 38.5,53.5 IC1.6 | v74,51 48.25,51 47.25,52 37,52
  Bottom 0.152: v77.25,37 75,39.25 75,51 | 75,51 75,56 C7_0.1UF.2 | v22.75,25.5 22.75,39.25 25.75,42.25 v25.75,50.75 25.75,51.5 24.5,52.75 24.5,60 23.75,60.75 JP2.2 | v74,51 75,51
OUT2R  (via drill 0.35)
  Top 0.152: 77,26.5 RDIR_F1.A 76.8,27.55 78.5,29.25 78.5,31.5 77.5,32.5 74,32.5 72.5,34 RDIR_B1.C 72.25,34 69.25,37 v69,37 | IC1.11 46.25,53.75 50,57.5 66,57.5 66.5,58 JP1.2
  Bottom 0.152: JP1.2 66.75,58 69.25,55.5 69.25,52.25 68,51 C8_0.1UF.2 68,50.75 69.5,49.25 69.5,40.5 69.25,40.25 69.25,37.25 v69,37
PIN_26  (via drill 0.35)
  Top 0.152: v45,32.25 44,31.25 43,31.25 U2.26 | v42.75,16.5 44.5,14.75 61.75,14.75 v66,19
  Bottom 0.152: v45,32.25 44.75,32 44.75,27 42.75,25 v42.75,16.5 | v66,19 67.5,20.5 67.5,24 69,25.5 69,32.25 68,33.25 SV3.7
PIN_40  (via drill 0.35)
  Top 0.152: v49.5,21.75 49.5,23.75 U2.40 | v57.5,33.25 65,33.25 SV3.8
  Bottom 0.152: v49.5,21.75 49.75,21.5 49.75,20.25 51.25,18.75 53.25,18.75 53.25,26 53.25,26.25 57.5,30.5 v57.5,33.25
PIN_41
  Top 0.152: SV3.6 66.25,29.75 67.75,29.75 69.75,27.75 71.5,27.75 71.5,24.5 70.75,23.75 55.25,23.75 54.25,24.75 50.25,24.75 50.25,24 U2.41
PWML  (via drill 0.35)
  Top 0.152: v61,37 51.75,37 51.75,35.25 U2.13 | v54.25,64.5 53.5,65.25 39.5,65.25 38.75,66 IC1.1
  Bottom 0.152: v61,37 60.5,37.5 60.5,47.75 58.75,49.5 58.75,60 v54.25,64.5
PWMR  (via drill 0.35)
  Top 0.152: v50,33.75 50.75,33.75 50.75,35 U2.14 | v47.75,43.5 47,44.25 v46.25,44.25
  Bottom 0.152: v50,33.75 50.25,34 50.25,41 v47.75,43.5 | v46.25,44.25 45.75,44.75 45.75,48 46,48.25 IC1.9
RESET  (via drill 0.35)
  Top 0.152: v60,27.75 54.25,27.75 U2.4 | 49,17 50,16 SV1.6 | 49,17 48.75,17.25 29.5,17.25 28.75,18 LED1.C | 49,17 60.5,17 61.5,18 JP9.2
  Bottom 0.152: v60,27.75 59.75,27.5 59.75,20 61.5,18.25 JP9.2
RS  (via drill 0.35)
  Top 0.152: v51.5,33.25 51,32.75 46.75,32.75 46.75,35 U2.19
  Bottom 0.152: v51.5,33.25 52.25,32.5 52.25,28.25 52,28 52,27.5 52.5,27 53.5,27 53.5,35 56.75,38.25 56.75,39.5 JP3.4
RW
  Top 0.152: U2.20 46.25,35 46.25,32.25 51.5,32.25 55.5,36.25 61.25,36.25 61.75,36.75 61.75,37.75 56.25,37.75 54.5,39.5 JP3.5
RXD
  Top 0.152: SV3.3 66.75,29.25 65.25,29.25 62.75,31.75 54.25,31.75 U2.9
SCK  (via drill 0.35)
  Top 0.152: v55.75,27 54.25,27 U2.3 | v54,19 53,18 v48,18
  Bottom 0.152: v55.75,27 54,25.25 v54,19 | v48,18 47.75,17.75 47.75,16 SV1.4
TXD
  Top 0.152: U2.10 54.25,32.5 64.5,32.5 65,32 66.75,32 67.75,31 SV3.5
V_BATT  (via drill 0.35)
  Top 0.152: IC1.8 38.75,48.25 39.25,47.75 39.5,47.75 40,47.25 40,46.25 4.75,46.25 4.25,46.75 4.25,47.75 7.5,51 JP8.1 | v63.25,13.5 62.75,13 56.5,13 55.75,12.25 v42,12.25 | v38.5,42.5 40.25,40.75 40.25,37.75 v39.75,37.75
  Bottom 0.152: JP5.1 10.5,60.75 8.5,58.75 8.5,55 9.25,54.25 9.25,53 7.5,51.25 JP8.1 | C3_10UF.1 33.25,16.5 37.93,11.82 R2_22K.2 | 40.25,12 R2_22K.2 | SV3.4 63.25,26.25 v63.25,13.5 | 41.75,12.25 40.5,12.25 40.5,12 R2_22K.2 | v38.5,42.5 38.5,48.25 IC1.8 | v39.75,37.75 40,37.5 40,17.25 41.75,15.5 41.75,12.25 | 41.75,12.25 v42,12.25
VCC  (via drill 0.35)
  Top 0.584: IC3.8 59.25,62.5 60.5,62.5 v61,63 67,63 v67.25,62.75 67.25,62.5 70.5,62.5 | 70.38,56.63 70.5,56.75 70.5,62.5 | 70.38,56.63 68,54.25 60,54.25 IC4.14 | 27.5,69.75 v26.75,69 | 27.5,69.75 28.75,69.75 IC2.2 29,70.25 v30,71.25 30.25,71.25 31.25,72.25 v37.5,72.25 | 27.5,69.75 v27.5,70.5 | 70.5,62.5 70.75,62.5 71,62.75 72.75,62.75 73.5,63.5 73.5,66 46.25,66 IC1.16 | v54.75,43 56,41.75 60,41.75 62,39.75 JP3.2 | 47.5,28.75 54,28.75 U2.5 54.5,28.75 v60,28.75 62,28.75 65,25.75 SV3.2 | 47.5,28.75 43,28.75 U2.29 | v47.5,25.5 47.75,25.5 47.75,24 U2.38 | v47.5,28.5 47.5,28.75 | U2.17 48.5,33.5 v47.5,33.5 | v47.25,30.25 43,30.25 U2.27 42.75,30.25 33.25,30.25 30,33.5 POT_10K.1 27.25,33.5 v25.75,32 | v76.75,50.25 70.38,56.63
  Bottom 0.584: R6_300E.2 16.75,62.75 16.75,58.25 17.25,57.75 C9_0.1UF.1 17.5,57.5 17.5,53.5 18.13,52.88 | 18.13,52.88 20.25,50.75 20.25,46.25 22.25,44.25 R23_1K.2 22.25,44 21,42.75 21,36.75 21.25,36.5 21.25,31.5 19.5,29.75 R8_300E.2 19.5,29.5 19.5,22.75 20.25,22 R11_10K.2 | 18.13,52.88 15.5,50.25 R35_10K.2 | R12_300E.2 30.25,8.25 28.75,9.75 28.75,14.5 R10_300E.2 28.5,14.75 21,22.25 R11_10K.2 | R9_10K.2 10.5,29.5 18,22 19.5,22 19.5,22.5 R11_10K.2 | R11_10K.2 20.5,22 23.75,25.25 23.75,32.25 25,33.5 R34_300E.1 24.75,33 v25.75,32 | v61,63 61,67.5 59.25,69.25 59.25,75 60.5,76.25 R19_10K.2 | v67.25,62.75 68.5,64 R18_300E.2 | v30,71.25 30,69.75 C2_0.1UF.1 | v26.75,69 23.5,69 R22_330E.2 | v27.5,70.5 27.5,72.25 26.25,73.5 R7_10K.2 | 37.75,72.25 37.75,72 39.38,70.38 | 37.75,72.25 37.75,74.5 38.5,75.25 R4_300E.2 | 39.38,70.38 43.5,66.25 46,66.25 IC1.16 | R5_10K.2 46,77.25 39.5,70.75 39.5,70.5 39.38,70.38 | v37.5,72.25 37.75,72.25 | R13_10K.2 52.25,8.25 52.5,8.5 52.5,10.75 55,13.25 SV1.9 55.25,13.5 56.5,14.75 56.5,24 56.25,24.25 56.25,26.25 58.5,28.5 R1_1K.1 58.75,28.75 59.38,29.38 | 59.38,29.38 59.5,29.5 59.5,33 R20_330E.2 59.75,33.25 62,33.25 62,39.5 JP3.2 | v54.75,43 54.75,46 54.25,46.5 R38_1K.1 | 77.63,27.38 79,28.75 79,30.25 R16_300E.2 | 77.63,27.38 75.25,25 R15_10K.2 75,24.75 73,22.75 72.25,22.75 72.25,22.25 71.5,21.5 71.5,19.25 72,18.75 72,17.75 71.25,17 65,17 | 77.63,27.38 75.63,29.38 | 75.63,29.38 73.75,31.25 73.75,37.5 R21_1K.2 | 77,50.25 78.25,51.5 R17_10K.2 | 77,50.25 77,38.5 78.25,37.25 78.25,34.75 75.75,32.25 75.75,29.5 75.63,29.38 | 65,17 65,25.5 SV3.2 | 65,17 65,13.5 63.5,12 R14_300E.2
  Bottom 0.584: v47.5,25.5 v47.5,28.5 47.5,30.25 | 47.5,30.25 v47.5,33.5 | v47.25,30.25 47.5,30.25 | v60,28.75 59.38,29.38 | v76.75,50.25 77,50.25